# EAGLE schematic STM32F767VG (EAGLE 8.3.2)
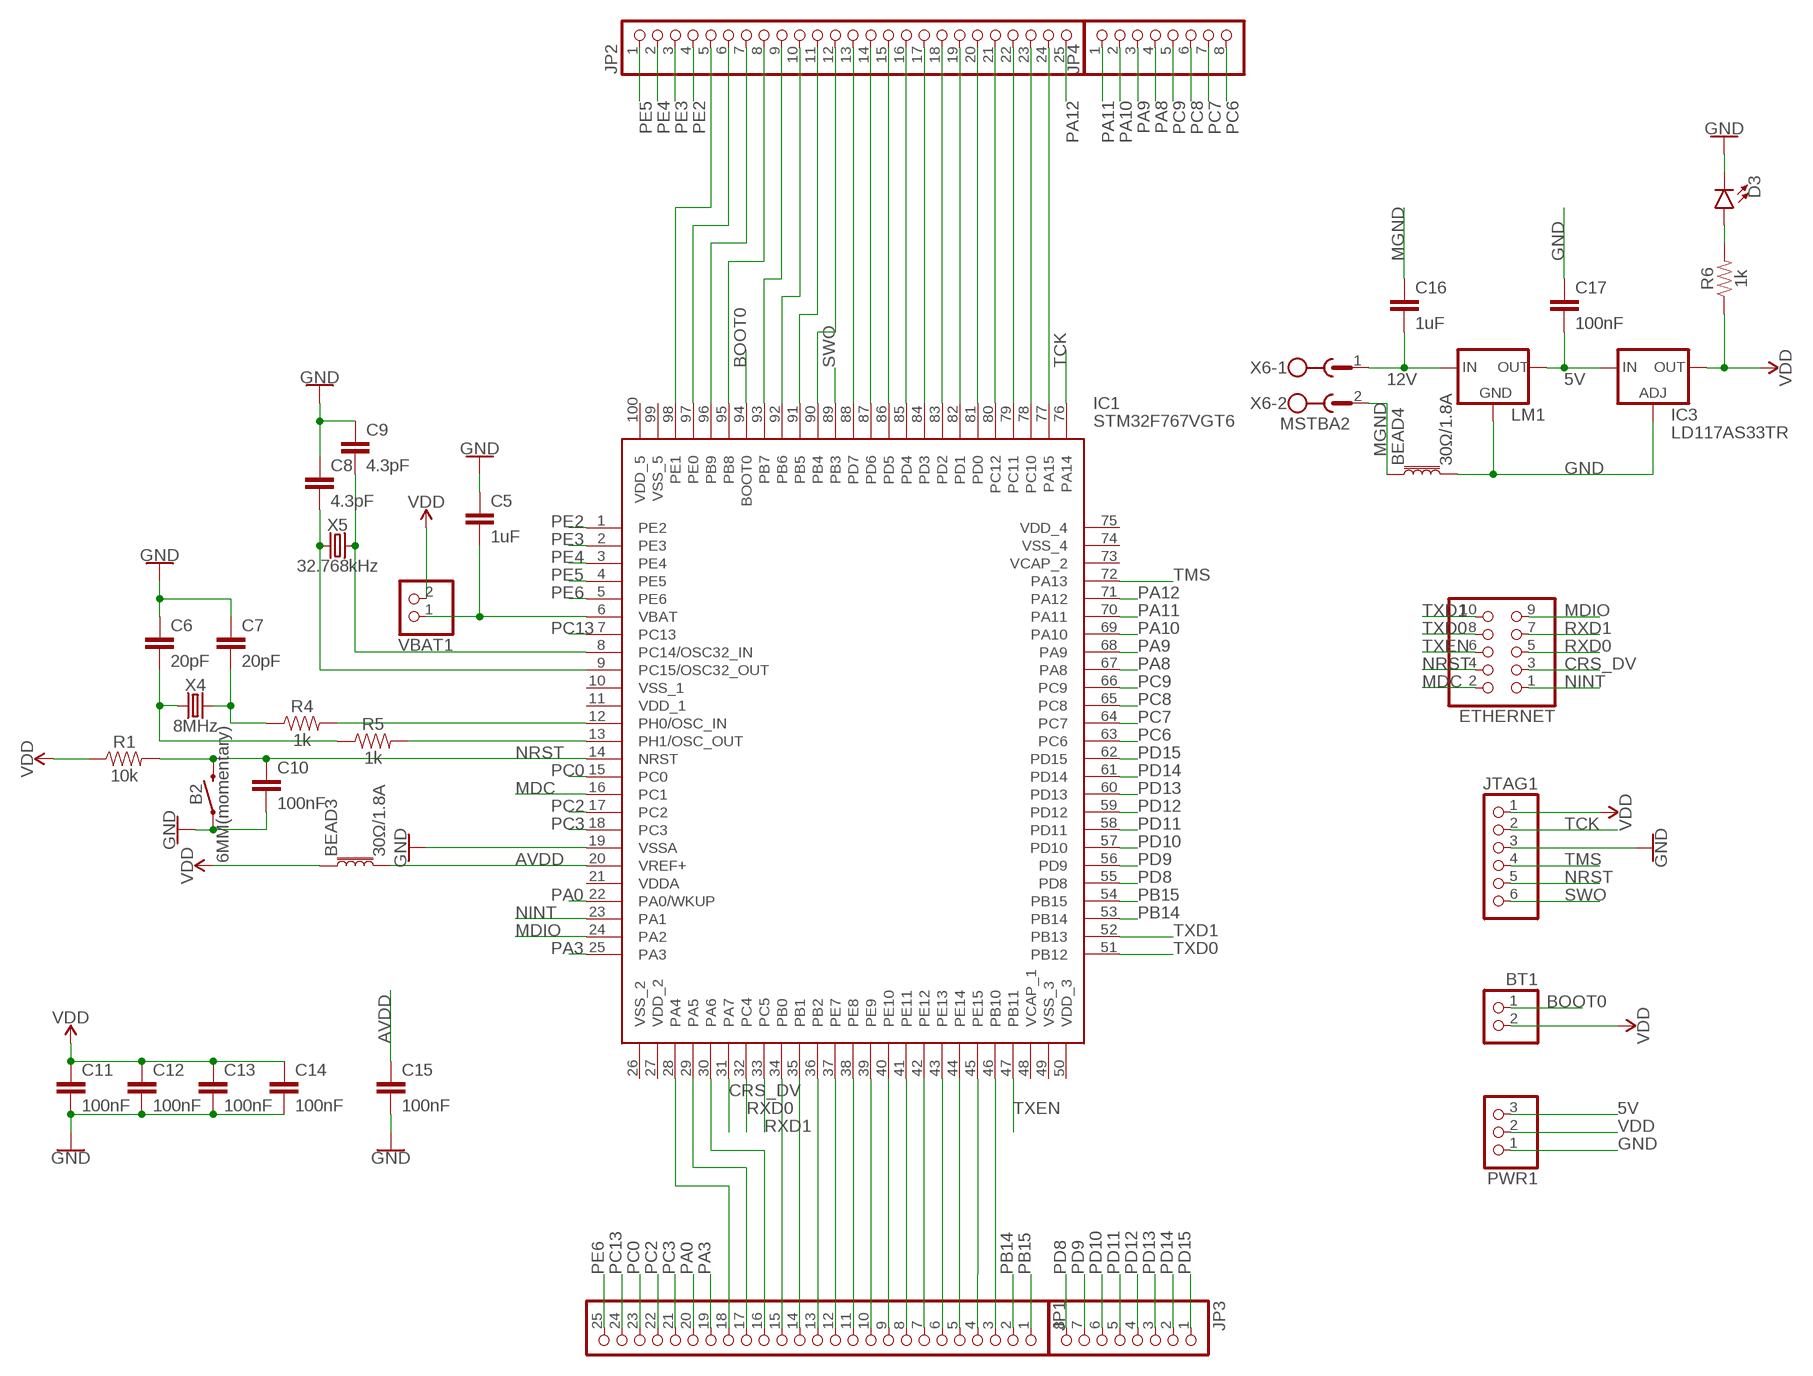
[diagram p0: schematic, sheet 1]

## Parts
B2  6MM(momentary)  MOMENTARY-SWITCH-SPST-PTH-6.0MM  [TACTILE_SWITCH_PTH_6.0MM]
BEAD3  30Ω/1.8A  FERRITE_BEAD-0603  [0603]
BEAD4  30Ω/1.8A  FERRITE_BEAD-0603  [0603]
BT1  PINHD-1X2  [1X02]
C5  1uF  C5P  [C050-030-075]
C6  20pF  C2.5P  [C025-030X050]
C7  20pF  C2.5P  [C025-030X050]
C8  4.3pF  C2.5P  [C025-030X050]
C9  4.3pF  C2.5P  [C025-030X050]
C10  100nF  C2.5P  [C025-030X050]
C11  100nF  C2.5P  [C025-030X050]
C12  100nF  C2.5P  [C025-030X050]
C13  100nF  C2.5P  [C025-030X050]
C14  100nF  C2.5P  [C025-030X050]
C15  100nF  C2.5P  [C025-030X050]
C16  1uF  C5P  [C050-030-075]
C17  100nF  C2.5P  [C025-030X050]
D3  LED5MM  [LED_5MM]
ETHERNET  PINHD-2X5  [2X05]
IC1  STM32F767VGT6  [QFP50P1600X1600X160-100N]
IC3  LD117AS33TR  [SOT223]
JP1  PINHD-1X25  [1X25]
JP2  PINHD-1X25  [1X25]
JP3  PINHD-1X8  [1X08]
JP4  PINHD-1X8  [1X08]
JTAG1  PINHD-1X6  [1X06]
LM1  V_REG_78XX-TO-220  [TO-220-ALT]
PWR1  PINHD-1X3  [1X03]
R1  10k  10KOHM-HORIZ-1/4W-1%  [AXIAL-0.3]
R4  1k  10KOHM-HORIZ-1/4W-1%  [AXIAL-0.3]
R5  1k  10KOHM-HORIZ-1/4W-1%  [AXIAL-0.3]
R6  1k  1KOHM-HORIZ-1/4W-1%  [AXIAL-0.3]
VBAT1  PINHD-1X2  [1X02]
X4  8MHz  CRYSTAL-8MHZSMD-HC49UP  [HC49UP]
X5  32.768kHz  CRYSTAL-32.768KHZPTH-2X6  [CRYSTAL-PTH-2X6-CYL]
X6  MSTBA2  [MSTBA2]

## Nets
5V: C17.2 IC3.3(IN) LM1.OUT PWR1.3
12V: C16.2 LM1.IN X6.1
AVDD: BEAD3.2 C15.1 IC1.20(VREF+)
BOOT0: BT1.1 IC1.94(BOOT0)
CRS_DV: ETHERNET.3 IC1.31(PA7)
GND: B2.1 BEAD4.2 C5.1 C6.1 C7.1 C8.1 C9.1 C10.2 C11.2 C12.2 C13.2 C14.2 C15.2 C17.1 D3.K(C) IC1.19(VSSA) IC3.1(ADJ) JTAG1.3 LM1.GND PWR1.1
MDC: ETHERNET.2 IC1.16(PC1)
MDIO: ETHERNET.9 IC1.24(PA2)
MGND: BEAD4.1 C16.1 X6.2
N$1: IC1.46(PB10) JP1.3
N$2: IC1.45(PE15) JP1.4
N$3: IC1.44(PE14) JP1.5
N$4: IC1.43(PE13) JP1.6
N$5: IC1.42(PE12) JP1.7
N$6: IC1.41(PE11) JP1.8
N$7: IC1.40(PE10) JP1.9
N$8: IC1.39(PE9) JP1.10
N$9: IC1.38(PE8) JP1.11
N$10: IC1.37(PE7) JP1.12
N$11: IC1.36(PB2) JP1.13
N$12: IC1.35(PB1) JP1.14
N$13: C5.2 IC1.6(VBAT) VBAT1.1
N$14: C9.2 IC1.8(PC14/OSC32_IN) X5.2
N$15: C8.2 IC1.9(PC15/OSC32_OUT) X5.1
N$16: IC1.12(PH0/OSC_IN) R4.P$2
N$18: IC1.34(PB0) JP1.15
N$19: IC1.13(PH1/OSC_OUT) R5.P$2
N$20: IC1.30(PA6) JP1.16
N$21: C6.2 R5.P$1 X4.1
N$22: C7.2 R4.P$1 X4.2
N$23: D3.A R6.P$2
N$24: IC1.29(PA5) JP1.17
N$25: IC1.28(PA4) JP1.18
N$33: IC1.92(PB6) JP2.10
N$34: IC1.93(PB7) JP2.9
N$35: IC1.95(PB8) JP2.8
N$36: IC1.96(PB9) JP2.7
N$37: IC1.97(PE0) JP2.6
N$39: IC1.88(PD7) JP2.13
N$43: IC1.84(PD3) JP2.17
N$45: IC1.82(PD1) JP2.19
N$48: IC1.79(PC11) JP2.22
N$49: IC1.78(PC10) JP2.23
N$50: IC1.77(PA15) JP2.24
N$58: IC1.87(PD6) JP2.14
N$59: IC1.86(PD5) JP2.15
N$60: IC1.85(PD4) JP2.16
N$64: IC1.80(PC12) JP2.21
N$65: IC1.81(PD0) JP2.20
N$67: IC1.83(PD2) JP2.18
N$71: IC1.91(PB5) JP2.11
N$72: IC1.90(PB4) JP2.12
NINT: ETHERNET.1 IC1.23(PA1)
NRST: B2.3 C10.1 ETHERNET.4 IC1.14(NRST) JTAG1.5 R1.P$2
PA0: IC1.22(PA0/WKUP) JP1.20
PA3: IC1.25(PA3) JP1.19
PA8: IC1.67(PA8) JP4.4
PA9: IC1.68(PA9) JP4.3
PA10: IC1.69(PA10) JP4.2
PA11: IC1.70(PA11) JP4.1
PA12: IC1.71(PA12) JP2.25
PB14: IC1.53(PB14) JP1.2
PB15: IC1.54(PB15) JP1.1
PC0: IC1.15(PC0) JP1.23
PC2: IC1.17(PC2) JP1.22
PC3: IC1.18(PC3) JP1.21
PC6: IC1.63(PC6) JP4.8
PC7: IC1.64(PC7) JP4.7
PC8: IC1.65(PC8) JP4.6
PC9: IC1.66(PC9) JP4.5
PC13: IC1.7(PC13) JP1.24
PD8: IC1.55(PD8) JP3.8
PD9: IC1.56(PD9) JP3.7
PD10: IC1.57(PD10) JP3.6
PD11: IC1.58(PD11) JP3.5
PD12: IC1.59(PD12) JP3.4
PD13: IC1.60(PD13) JP3.3
PD14: IC1.61(PD14) JP3.2
PD15: IC1.62(PD15) JP3.1
PE2: IC1.1(PE2) IC1.98(PE1) JP2.4 JP2.5
PE3: IC1.2(PE3) JP2.3
PE4: IC1.3(PE4) JP2.2
PE5: IC1.4(PE5) JP2.1
PE6: IC1.5(PE6) JP1.25
RXD0: ETHERNET.5 IC1.32(PC4)
RXD1: ETHERNET.7 IC1.33(PC5)
SWO: IC1.89(PB3) JTAG1.6
TCK: IC1.76(PA14) JTAG1.2
TMS: IC1.72(PA13) JTAG1.4
TXD0: ETHERNET.8 IC1.51(PB12)
TXD1: ETHERNET.10 IC1.52(PB13)
TXEN: ETHERNET.6 IC1.47(PB11)
VDD: BEAD3.1 BT1.2 C11.1 C12.1 C13.1 C14.1 IC3.4(OUT) JTAG1.1 PWR1.2 R1.P$1 R6.P$1 VBAT1.2

## Power pins joined to a net without a drawn wire
VCAP_1: IC1.48(VCAP_1)
VCAP_2: IC1.73(VCAP_2)
VDD_1: IC1.11(VDD_1)
VDD_2: IC1.27(VDD_2)
VDD_3: IC1.50(VDD_3)
VDD_4: IC1.75(VDD_4)
VDD_5: IC1.100(VDD_5)
VDDA: IC1.21(VDDA)
VSS_1: IC1.10(VSS_1)
VSS_2: IC1.26(VSS_2)
VSS_3: IC1.49(VSS_3)
VSS_4: IC1.74(VSS_4)
VSS_5: IC1.99(VSS_5)

## Library data of the parts
B2 = SparkFun-Switches:MOMENTARY-SWITCH-SPST: Momentary Switch (Pushbutton) - SPST Normally-open (NO) SPST momentary switches (buttons, pushbuttons). Variants PTH-12MM - 12mm square, through-hole Momentary Pushbutton Switch - 12mm Square <https://www.sparkfun.com/products/9190> (COM-09190) PTH-6.0MM, PTH-6.0MM-KIT - 6.0mm square, through-hole Mini Pushbutton Switch <https://www.sparkfun.com/products/97> (COM-00097) KIT package intended for soldering kit's - only one side of pads' copper is exposed. PTH-RIGHT-ANGLE-KIT - Right-angle, through-hole Right Angle Tactile Button <https://www.sparkfun.com/products/10791> - Used on SparkFun BigTime Watch Kit <https://www.sparkfun.com/products/11734> SMD-12MM - 12mm square, surface-mount Tactile Button - SMD (12mm) <https://www.sparkfun.com/products/12993> (COM-12993) Used on SparkFun PicoBoard <https://www.sparkfun.com/products/11888> SMD-4.5MM - 4.5mm Square Trackball Switch Used on SparkFun Blackberry Trackballer Breakout <https://www.sparkfun.com/products/13169> SMD-4.6MMX2.8MM - 4.60mm x 2.80mm, surface mount Used on SparkFun SAMD21 Mini Breakout <https://www.sparkfun.com/products/13664> SMD-5.2MM, SMD-5.2-REDUNDANT - 5.2mm square, surface-mount Mini Pushbutton Switch - SMD <https://www.sparkfun.com/products/8720> (COM-08720) Used on Arduino Pro Mini <https://www.sparkfun.com/products/11114> REDUNDANT package connects both switch circuits together SMD-6.0X3.5MM - 6.0 x 3.5mm, surface mount Momentary Reset Switch SMD <https://www.sparkfun.com/products/8229> (COM-08229) SMD-6.2MM-TALL - 6.2mm square, surface mount Tactile Button - SMD (6mm) <https://www.sparkfun.com/products/12992> Used on SparkFun Digital Sandbox <https://www.sparkfun.com/products/12651> SMD-RIGHT-ANGLE - Right-angle, surface mount Used on SparkFun Block for Intel® Edison - Arduino <https://www.sparkfun.com/products/13036>; PROD_ID: SWCH-08441; SF_SKU: COM-00097
BEAD3 BEAD4 = SparkFun-Coils:FERRITE_BEAD: Ferrite Bead (blocks, cores, rings, chokes, etc.) Inductor with layers of ferrite used to suppress high frequencies. Often used to isolate high frequency noise. SparkFun Products: IOIO-OTG - V2.2 <https://www.sparkfun.com/products/13613> SparkFun SAMD21 Mini Breakout <https://www.sparkfun.com/products/13664> SparkFun 6 Degrees of Freedom Breakout - LSM6DS3 <https://www.sparkfun.com/products/13339> SparkFun SAMD21 Dev Breakout <https://www.sparkfun.com/products/13672>; PROD_ID: NDUC-13805
BT1 VBAT1 = pinhead:PINHD-1X2: PIN HEADER
C5-C17 = ee2parts:C: Capacitor
D3 = SparkFun-LED:LED: LED (Generic) Standard schematic elements and footprints for 5mm, 3mm, 1206, and 0603 sized LEDs. Generic LEDs with no color specified.
ETHERNET = pinhead:PINHD-2X5: PIN HEADER
IC1 = STM32F767VGT6:STM32F767VGT6: ARM Microcontrollers - MCU 16/32-BITS MICROS Source: Datasheet <https://www.arrow.com/en/products/stm32f767vgt6/stmicroelectronics>; ARROW_PART_NUMBER: STM32F767VGT6; ARROW_PRICE-STOCK: https://www.arrow.com/en/products/stm32f767vgt6/stmicroelectronics; DESCRIPTION: ARM Microcontrollers - MCU 16/32-BITS MICROS; HEIGHT: 1.6mm; MANUFACTURER_NAME: STMicroelectronics; MANUFACTURER_PART_NUMBER: STM32F767VGT6
IC3 = v-reg:LD117A?*: Low drop fixed and adjustable positive voltage regulators 1 A Source: http://www.st.com/stonline/products/literature/ds/7194/ld1117axx.pdf
JP1 JP2 = pinhead:PINHD-1X25: PIN HEADER
JP3 JP4 = pinhead:PINHD-1X8: PIN HEADER
JTAG1 = pinhead:PINHD-1X6: PIN HEADER
LM1 = SparkFun-IC-Power:V_REG_78XX: Voltage Regulator Standard 78xx regulator. IGO (Input Ground Output). Spark Fun Electronics SKU : COM-00107; PROD_ID: VREG-08450; SF_ID: COM-00107
PWR1 = pinhead:PINHD-1X3: PIN HEADER
R1 = SparkFun-Resistors:10KOHM: 10kΩ resistor A resistor is a passive two-terminal electrical component that implements electrical resistance as a circuit element. Resistors act to reduce current flow, and, at the same time, act to lower voltage levels within circuits. - Wikipedia; PROD_ID: RES-12183
R4 R5 = SparkFun-Resistors:10KOHM: 10kΩ resistor A resistor is a passive two-terminal electrical component that implements electrical resistance as a circuit element. Resistors act to reduce current flow, and, at the same time, act to lower voltage levels within circuits. - Wikipedia; PROD_ID: RES-12183; VALUE: 10k
R6 = SparkFun-Resistors:1KOHM: 1kΩ resistor A resistor is a passive two-terminal electrical component that implements electrical resistance as a circuit element. Resistors act to reduce current flow, and, at the same time, act to lower voltage levels within circuits. - Wikipedia; PROD_ID: RES-12182
X4 = SparkFun-Clocks:CRYSTAL-8MHZ: 8MHz Crystal Datasheet Example <http://www.futureelectronics.com/en/technologies/electromechanical/timing-devices/crystals/Pages/6008189-ABM3B-8.000MHZ-B2-T.aspx?IM=0> Frequency: 8MHz Frequency Tolerance: ±20ppm Load Capacitance: 18pF SparkFun Products: Pro Micro -3.3V/8MHz <https://www.sparkfun.com/products/12587> WAV Trigger <https://www.sparkfun.com/products/13660>; PROD_ID: XTAL-11706
X5 = SparkFun-Clocks:CRYSTAL-32.768KHZ: 32.768kHz Crystal Frequency: 32.768kHz Frequency Stability: ±20ppm Load Capacitance: 12.5pF (PTH-2X6 & SMD-3.2X1.5), 6pF (SMD-2X6) SparkFun Products: SparkFun BigTime Watch Kit <https://www.sparkfun.com/products/11734> SparkFun nRF52832 Breakout <https://www.sparkfun.com/products/13990> SparkFun Real Time Clock Module <https://www.sparkfun.com/products/12708>; PROD_ID: XTAL-10112
X6 = con-phoenix-508:MSTBA2: PHOENIX; MF: FARNELL; MPN: 1757242; OC_FARNELL: 3705171; OC_NEWARK: 71C4161

## Net classes
0 default: width 0.178 mm, drill 0.178 mm, clearance 0.178 mm